# EAGLE design MQTTButton (EAGLE 9.3.0)
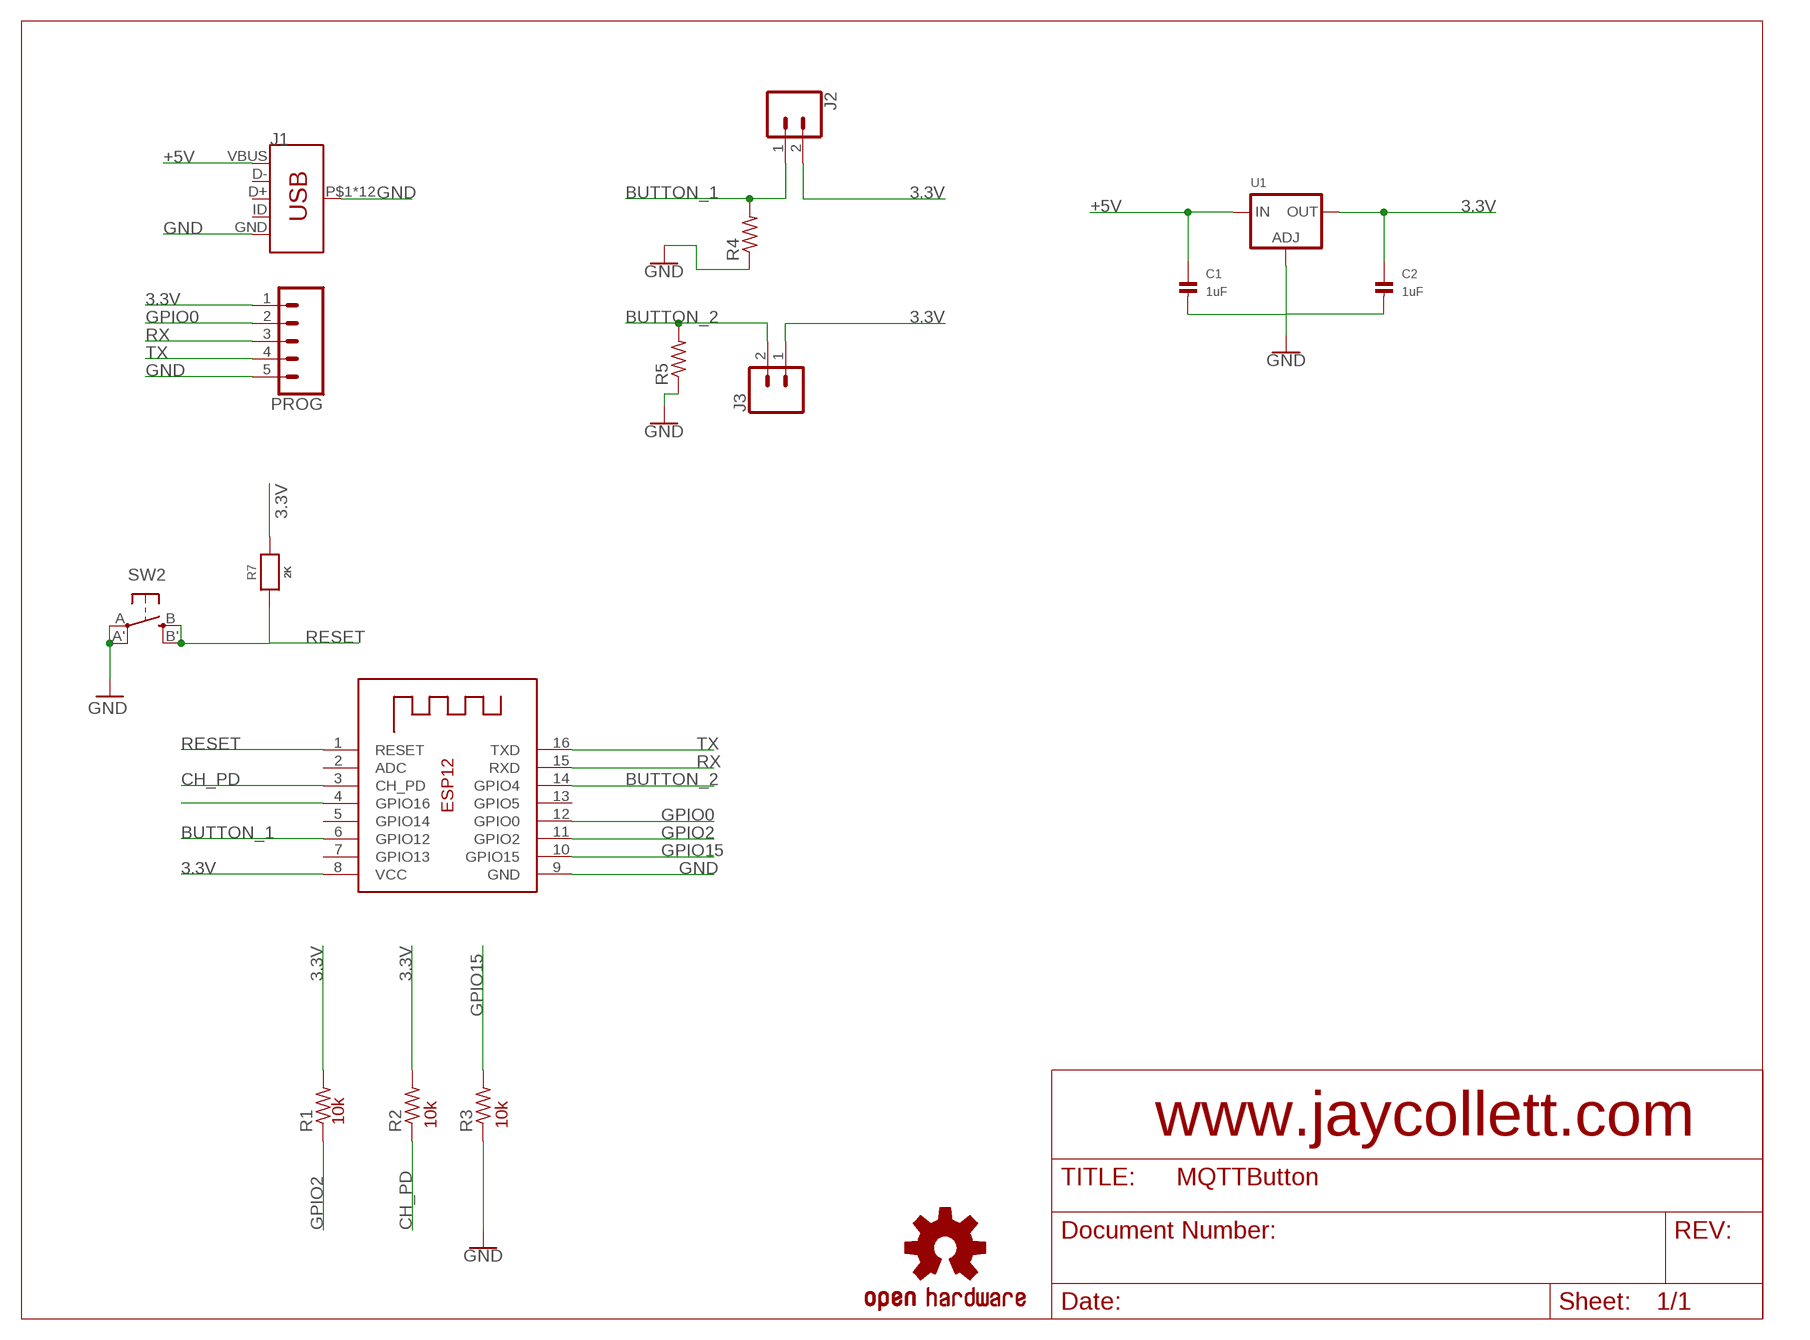
[diagram p0: schematic, sheet 1]

## Parts
C1  1uF  CAP_CERAMIC0805  [0805]
C2  1uF  CAP_CERAMIC0805  [0805]
J1  USB_MICRO-B_HALF_PTH  [USB-MICROB-PTH]
J2  CONN_02LOCK  [1X02_LOCK]
J3  CONN_02LOCK  [1X02_LOCK]
LOGO1  OSHW-LOGOMINI  [OSHW-LOGO-MINI]
PROG  CONN_05  [1X05]
R1  10k  R-US_M0805  [M0805]
R2  10k  R-US_M0805  [M0805]
R3  10k  R-US_M0805  [M0805]
R4  10k  R-US_M0805  [M0805]
R5  10k  R-US_M0805  [M0805]
R7  2K  RESISTOR0805_NOOUTLINE  [0805-NO]
SW2  SPST_TACT-EVQQ2  [EVQ-Q2]
U1  LM1117SOT223-WAVE  [SOT223-W]
X1  ESP-12  [ESP-12]

## Nets
3.3V [3.3V]: C2.1 J2.2 J3.1 PROG.1 R1.2 R2.2 R7.2 U1.2(OUT) X1.8(VCC)
+5V: C1.1 J1.VBUS U1.3(IN)
BUTTON_1: J2.1 R4.2 X1.6(GPIO12)
BUTTON_2: J3.2 R5.2 X1.14(GPIO4)
CH_PD: R2.1 X1.3(CH_PD)
GND: C1.2 C2.2 J1.GND J1.P$1(SHIELD) J1.P$2(SHIELD) J1.P$3(SHIELD) J1.P$4(SHIELD) J1.P$6(SHIELD) J1.P$8(SHIELD) J1.P$10(SHIELD) J1.P$12(SHIELD) J1.SHEILD2(SHIELD) J1.SHIELD J1.SHIELD3(SHIELD) J1.SHIELD4(SHIELD) PROG.5 R3.1 R4.1 R5.1 SW2.A'(P1) SW2.A(P) U1.1(ADJ) X1.9(GND)
GPIO0: PROG.2 X1.12(GPIO0)
GPIO2: R1.1 X1.11(GPIO2)
GPIO15: R3.2 X1.10(GPIO15)
N$4: X1.4(GPIO16)
RESET: R7.1 SW2.B'(S1) SW2.B(S) X1.1(RESET)
RX: PROG.3 X1.15(RXD)
TX: PROG.4 X1.16(TXD)
Unconnected: J1.D+ J1.D- J1.ID X1.2(ADC) X1.5(GPIO14) X1.7(GPIO13) X1.13(GPIO5)

## Notes on the sheet
- 10k | 10k | 10k
- www.jaycollett.com

## Library data of the parts
C1 C2 = microbuilder:CAP_CERAMIC: Ceramic Capacitors 0402 - 0402 Surface Mount Capacitors 16pF 50V 5% [Digikey: 445-4899-2-ND] 18pF 50V 5% [Digikey: 490-1281-2-ND] 22pF 50V 5% [Digikey: 490-1283-2-ND] 68pF 50V 5% [Digikey: 490-1289-2-ND] 0.1uF 10V 10% [Digikey: 490-1318-2-ND] 1.0uF 6.3V 10% [Digikey: 490-1320-2-ND] 0603 - 0603 Surface Mount Capacitors 16 pF 50V 5% [Digikey: 445-5051-2-ND] 22 pF 50V [Digikey: PCC220ACVTR-ND] 33 pF 50V 5% [Digikey: 490-1415-1-ND] 56pF 50V 5% [Digikey: 490-1421-1-ND] 220pF 50V 5% [Digikey: 445-1285-1-ND] 680 pF 50V 2200 pF 50V 5% C0G [Digikey: 445-1297-1-ND] 5600 pF 100V 5% X7R [Digikey: 478-3711-1-ND] 0.1 µF 25V 10% [Digikey: PCC2277TR-ND] 0.22 µF 16V 10% X7R [Digikey: 445-1318-1-ND] 1.0 µF 25V 10% [Digikey: 445-5146-2-ND] 0603 - RF Specific 3pF 250V +/-0.1pF RF [Digikey: 712-1347-1-ND] 18 pF 250V 5% [Digikey: 478-3505-1-ND or 712-1322-1-ND] 56 pF 250V 5% C0G RF [Digikey: 490-4867-1-ND] 68 pF 250V RF [Digikey: 490-4868-1-ND] 0805 - 0805 Surface Mount Capacitors 220 pF 250V 2% RF Ceramic Capacitor [Digikey: 712-1398-1-ND] 1000 pF 50V 2% NP0 Ceramic Capacitor [Digikey: 478-3760-1-ND] 0.1 µF 25V 10% Ceramic Capacitor [Digikey: PCC1828TR-ND] 1.0 µF 16V 10% Ceramic Capacitor[Digikey: 490-1691-2-ND] 10.0 µF 10V 10% Ceramic Capacitor[Digikey: 709-1228-1-ND] 10.0 uF 16V 10% Ceramic Capacitor [Digikey: 478-5165-2-ND] 47 uF 6.3V 20% Ceramic Capacitor [Digikey: 587-1779-1-ND or 399-5506-1-ND] 1206 - 1206 Surface Mount Capacitors 47uF 10V 20% Ceramic Capacitor [Digikey: 490-5528-1-ND or 399-5508-1-ND or 445-6010-1-ND] 100uF 6.3V -20%, +80% Y5V Ceramic Capacitor (Digikey: 490-4512-1-ND, Mouser: 81-GRM31CF50J107ZE1L)
J1 = SparkFun-Connectors:USB_MICRO-B: USB Type Micro-B Connector Male/female and PTH/SMT variants SparkFun Products: SparkFun microB USB Breakout <https://www.sparkfun.com/products/12035> SparkFun USB microB Plug Breakout <https://www.sparkfun.com/products/10031> SparkFun ESP8266 Thing <https://www.sparkfun.com/products/13231>; PROD_ID: CONN-13711; VALUE: AMP FCI 10103594-0001LF
J2 J3 = SparkFun-Connectors:CONN_02: Multi connection point. Often used as Generic Header-pin footprint for 0.1 inch spaced/style header connections On any of the 0.1 inch spaced packages, you can populate with these: Break Away Headers - Straight <https://www.sparkfun.com/products/116> (PRT-00116) Break Away Male Headers - Right Angle <https://www.sparkfun.com/products/553> (PRT-00553) Female Headers <https://www.sparkfun.com/products/115> (PRT-00115) Break Away Headers - Machine Pin <https://www.sparkfun.com/products/117> (PRT-00117) Break Away Female Headers - Swiss Machine Pin <https://www.sparkfun.com/products/743> (PRT-00743) For SCREWTERMINALS and SPRING TERMINALS visit here: Screw Terimnals on SparkFun.com <https://www.sparkfun.com/search/results?term=Screw+Terminals> (5mm/3.5mm/2.54mm spacing) This device is also useful as a general connection point to wire up your design to another part of your project. Our various solder wires solder well into these plated through hole pads. Hook-Up Wire - Assortment (Stranded, 22 AWG) <https://www.sparkfun.com/products/11375> (PRT-11375) Hook-Up Wire - Assortment (Solid Core, 22 AWG) <https://www.sparkfun.com/products/11367> (PRT-11367) View the entire wire category on our website here <https://www.sparkfun.com/categories/141> Special notes: Molex polarized connector foot print use with: PRT-08233 with associated crimp pins and housings. 2.54_SCREWTERM for use with PRT-10571. 3.5mm Screw Terminal footprints for PRT-08084 5mm Screw Terminal footprints for use with PRT-08432
LOGO1 = SparkFun-Aesthetics:OSHW-LOGO: Open-Source Hardware (OSHW) Logo This logo indicates the piece of hardware it is found on incorporates a OSHW license and/or adheres to the definition of open source hardware found here: http://freedomdefined.org/OSHW
PROG = SparkFun-Connectors:CONN_05: Multi connection point. Often used as Generic Header-pin footprint for 0.1 inch spaced/style header connections On any of the 0.1 inch spaced packages, you can populate with these: Break Away Headers - Straight <https://www.sparkfun.com/products/116> (PRT-00116) Break Away Male Headers - Right Angle <https://www.sparkfun.com/products/553> (PRT-00553) Female Headers <https://www.sparkfun.com/products/115> (PRT-00115) Break Away Headers - Machine Pin <https://www.sparkfun.com/products/117> (PRT-00117) Break Away Female Headers - Swiss Machine Pin <https://www.sparkfun.com/products/743> (PRT-00743) For SCREWTERMINALS and SPRING TERMINALS visit here: Screw Terimnals on SparkFun.com <https://www.sparkfun.com/search/results?term=Screw+Terminals> (5mm/3.5mm/2.54mm spacing) This device is also useful as a general connection point to wire up your design to another part of your project. Our various solder wires solder well into these plated through hole pads. Hook-Up Wire - Assortment (Stranded, 22 AWG) <https://www.sparkfun.com/products/11375> (PRT-11375) Hook-Up Wire - Assortment (Solid Core, 22 AWG) <https://www.sparkfun.com/products/11367> (PRT-11367) View the entire wire category on our website here <https://www.sparkfun.com/categories/141> Special notes: Molex polarized connector foot print use with SKU : PRT-08231 with associated crimp pins and housings. 1MM SMD Version SKU: PRT-10208
R1-R5 = adafruit:R-US_: RESISTOR, American symbol
R7 = microbuilder:RESISTOR: Resistors For new designs, use the packages preceded by an '_' character since they are more reliable: The following footprints should be used on most boards: _0402 - Standard footprint for regular board layouts _0603 - Standard footprint for regular board layouts _0805 - Standard footprint for regular board layouts _1206 - Standard footprint for regular board layouts For extremely tight-pitch boards where space is at a premium, the following 'micro-pitch' footprints can be used (smaller pads, no silkscreen outline, etc.): _0402MP - Micro-pitch footprint for very dense/compact boards _0603MP - Micro-pitch footprint for very dense/compact boards _0805MP - Micro-pitch footprint for very dense/compact boards _1206MP - Micro-pitch footprint for very dense/compact boards
SW2 = adafruit:SPST_TACT: SMT 6mm switch, EVQQ2 series http://www.ladyada.net/library/eagle
U1 = microbuilder:LM1117: LM1117 Voltage Regulator LM1117 Adjustable Voltage regulator [Digikey: LM1117IMP-ADJDKR-ND] LM1117 3.3V Voltage regulator [AP1117E33GDIDKR-ND] LM1117 5.0V Voltage regulator [AP1117E50GDIDKR-ND] SOT223-REFLOW - SOT223 package for solder paste/reflow ovens SOT223-WAVE - SOT223 package for hand-soldering (larger pads) Note: For the fixed-voltage regulators, simply set the ADJ pin to GND.
X1 = adafruit:ESP-12

## Net classes
1 3.3V: width 0.406 mm, clearance 0.203 mm to class 0

## Board
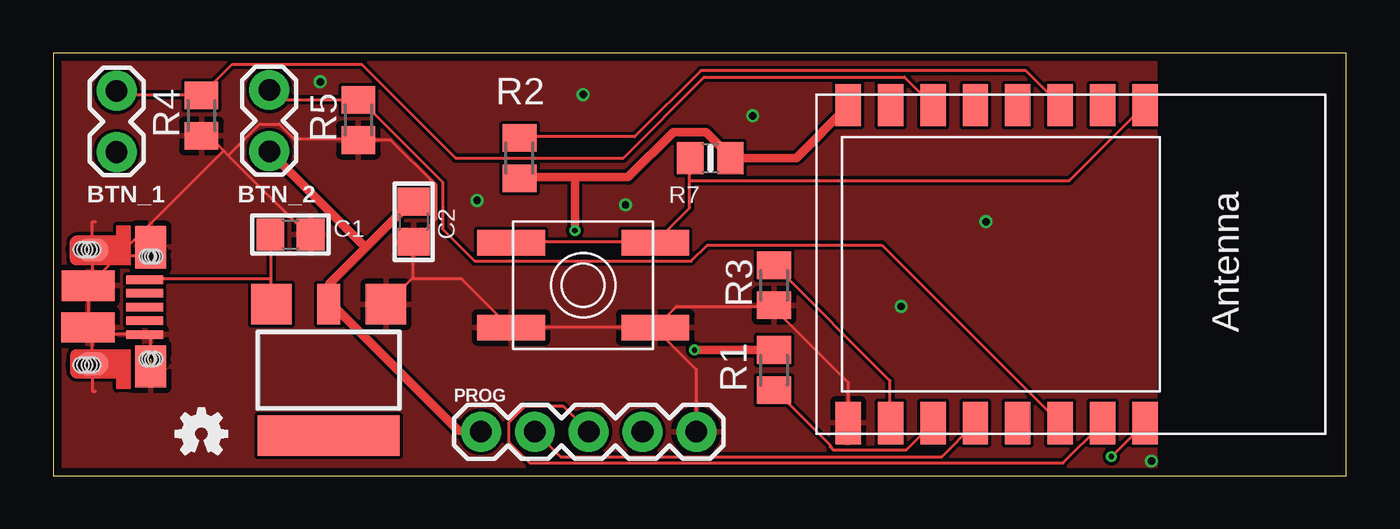
[diagram p1: board, top side]
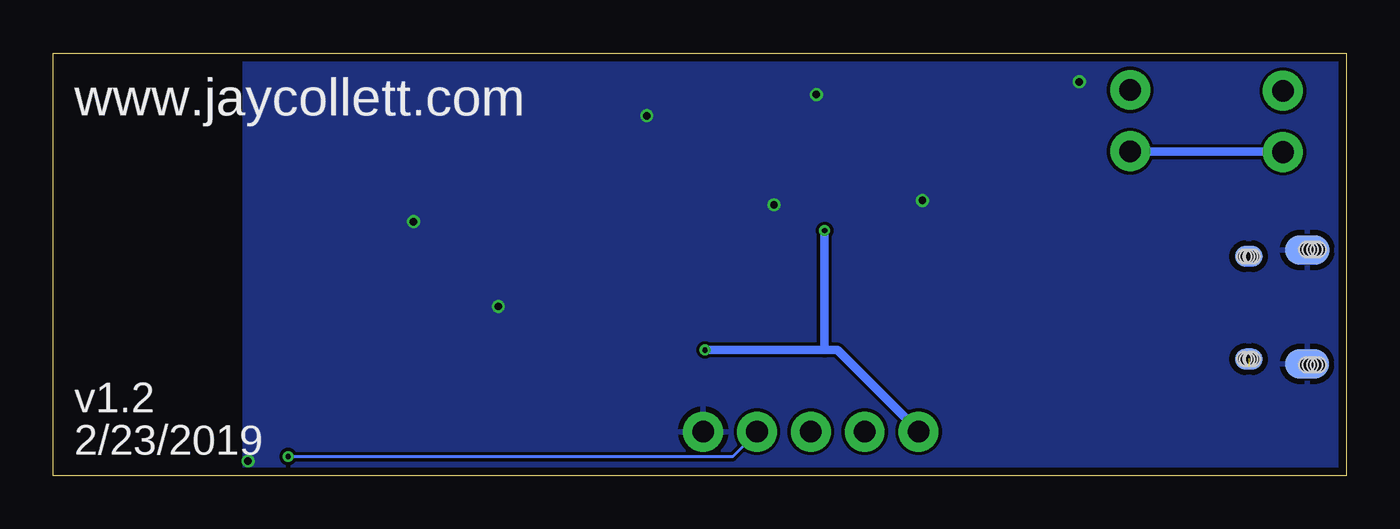
[diagram p2: board, bottom side, seen from below]

Size 61 x 19.96 mm. Coordinates in mm from the lower left corner, seen from the top.
Outline: 0,0 61,0 61,19.96 0,19.96 0,0
Copper layers (1*16): Top 0.035559375mm / dielectric 1.6mm / Bottom 0.035559375mm
Design rules "default": minimum track width 6mil, minimum drill 10mil, track to track 6mil, track to pad 6mil, pad to pad 6mil, via to via 6mil, smd to smd 6mil, copper to edge 15mil, drill to drill 6mil, minimum pad ring 5mil, minimum via ring 5mil, stop-mask expansion 2.5mil, vias tented up to drill 20mil, thermal gap 10mil

### Footprints (pad centres in the part's own frame; a part is rotated, then mirrored left to right if it is on the bottom)
0805 = smd 1.3 x 1.5: 1 -0.95,0; 2 0.95,0
USB-MICROB-PTH = smd 0.4 x 1.75: D+ 0.031,1.331; D- -0.619,1.331; GND 1.331,1.331; ID 0.681,1.331; VBUS -1.269,1.331 | smd 1.4 x 2.1 bottom: P$1 2.701,-1.142; P$3 -2.659,-1.144 | smd 1 x 1.3: P$2 2.487,1.594; P$6 -2.368,1.604 | smd 1 x 1.3 bottom: P$4 -2.368,1.604; P$10 2.481,1.598 | smd 1.1 x 1.5: P$8 2.701,-1.142; P$12 -2.659,-1.144 | smd 2 x 1.46: SHEILD2 2.831,1.606; SHIELD -2.794,1.606 | smd 1.425 x 2.5: SHIELD3 -0.979,-1.349; SHIELD4 0.996,-1.352 | hole 0.7: -2.693,-1.134; -2.693,-1.3; -2.694,-1.499; -2.694,-1.664; 2.768,-1.134; 2.767,-1.303; 2.766,-1.496; 2.766,-1.664 | hole 0.66: -2.359,1.821; -2.349,1.691; -2.359,1.541; -2.354,1.432; 2.481,1.821; 2.491,1.691; 2.481,1.541; 2.486,1.432
1X02_LOCK = drill 1.016 pad 1.88: 1 -0.178,0; 2 2.718,0
1X05 = drill 1.016 pad 1.88: 1 0,0; 2 2.54,0; 3 5.08,0; 4 7.62,0; 5 10.16,0
M0805 = smd 1.3 x 1.6: 1 -0.95,0; 2 0.95,0
0805-NO = smd 1.24 x 1.5: 1 -0.95,0; 2 0.95,0
EVQ-Q2 = smd 3.2 x 1.2: A -3.4,-2; A' 3.4,-2; B -3.4,2; B' 3.4,2
SOT223-W = smd 1.9 x 1.9: 1 -2.7,-3.1; 3 2.7,-3.1 | smd 1.1 x 1.9: 2 0,-3.1 | smd 6.7 x 1.9: 4 0,3.1
ESP-12 = smd 2 x 1.2: 1 -7.5,4.5; 2 -7.5,2.5; 3 -7.5,0.5; 4 -7.5,-1.5; 5 -7.5,-3.5; 6 -7.5,-5.5; 7 -7.5,-7.5; 8 -7.5,-9.5; 9 7.5,-9.5; 10 7.5,-7.5; 11 7.5,-5.5; 12 7.5,-3.5; 13 7.5,-1.5; 14 7.5,0.5; 15 7.5,2.5; 16 7.5,4.5

### Placement (x,y rotation side)
C1  11.2,11.4 0 top
C2  17,12 270 top
J1  3,8 270 top
J2  3,18 270 top
J3  10.2,15.5 90 top
LOGO1  7,2 0 top
PROG  20.18,2.09 0 top
R1  34,5 90 top
R2  22,15 270 top
R3  34,9 90 top
R4  7,17 90 top
R5  14.4,16.8 90 top
R7  31,15 0 top
SW2  25,9 0 top
U1  13,5 180 top
X1  47,10 270 top

### Tracks (layer width: path | path; a pad name or v marks a point on that pad's centre or on a via)
3.3V  (via drill 0.25)
  Top 0.406: 14.74,10.78 13.03,9.07 13.03,8.15 U1.2 13.18,8.08 19.13,2.13 20.12,2.13 PROG.1 | 14.74,10.78 16.84,12.88 16.99,12.88 C2.1 | 14.74,10.78 10.21,15.32 J3.1 | X1.8 37.49,17.45 35.05,15.01 32,15.01 R7.2 31.85,15.16 30.79,16.23 29.26,16.23 27.13,14.1 24.61,14.1 | 24.61,14.1 22.02,14.1 R2.2 | v30.25,5.94 33.98,5.94 R1.2 | v24.61,11.58 24.61,14.1
  Bottom 0.406: J2.2 3.05,15.32 10.13,15.32 J3.1 | 24.61,5.94 24,5.94 20.19,2.13 PROG.1 | 24.61,5.94 v30.25,5.94 | 24.61,5.94 v24.61,11.58
+5V
  Top 0.152: 10.29,9.3 10.29,8.15 U1.3 | 10.29,9.3 10.29,11.35 C1.1 | 10.29,9.3 4.34,9.3 J1.VBUS
BUTTON_1
  Top 0.152: J2.1 3.05,18.14 3.2,17.98 6.93,17.98 R4.2 7.01,17.98 8.46,19.43 14.55,19.43 18.97,15.01 26.9,15.01 30.71,18.82 40.16,18.82 41.45,17.53 X1.6
BUTTON_2
  Top 0.152: J3.2 10.21,18.21 10.67,17.75 14.33,17.75 R5.2 14.4,17.68 14.55,17.68 18.36,13.87 18.36,11.66 19.89,10.13 30.1,10.13 30.86,10.9 39.09,10.9 47.47,2.52 X1.14
CH_PD
  Top 0.152: R2.1 22.02,16 27.43,16 30.56,19.13 45.87,19.13 47.47,17.53 X1.3
GND  (via drill 0.35)  (3 unrouted)
  Top 0.152: 1.8,6.8 1.68,6.93 J1.SHIELD4 1.68,7.01 1.68,8.91 J1.SHIELD3 1.68,8.99 1.84,9.16 | 1.8,6.8 1.91,6.71 4.27,6.71 J1.GND 4.61,6.67 J1.SHEILD2 | 8.04,15.35 7.39,16 7.01,16 R4.1 | 8.04,15.35 8.27,15.13 | 8.27,15.13 11.96,11.43 12.12,11.43 C1.2 | 8.27,15.13 9.75,16.61 10.67,16.61 11.35,15.93 14.33,15.93 R5.1 15.93,15.85 18.06,13.72 18.06,12.12 17.07,11.12 C2.2 16.99,9.37 16.95,9.34 | 8.04,15.35 1.84,9.16 | 16.95,9.34 15.77,8.15 U1.1 | 16.95,9.34 16.99,9.3 19.28,9.3 21.57,7.01 SW2.A 21.64,7.01 28.35,7.01 SW2.A' | SW2.A' 28.42,7.01 29.41,8 33.98,8 R3.1 33.98,7.92 37.49,4.42 37.49,2.52 X1.9 | PROG.5 30.33,2.13 30.33,5.03 28.42,6.93 SW2.A' | 1.8,6.8 1.86,6.8 J1.P$8 1.86,4 2,4 | J1.P$3 1.86,9.16 1.84,9.16 | J1.P$4 1.86,10.37 J1.P$3 | J1.P$3 1.86,12 2,12
  other vias: 44,12 33,17 25,18 20,13 40,8 27,12.8 12.6,18.6 51.8,0.7
  pour Top (isolate 0.012): 0,20 52,20 52,0 0,0
  pour Bottom (isolate 0.012): 0,20 52,20 52,0 0,0
GPIO0
  Top 0.152: X1.12 43.43,2.44 41.91,0.91 23.93,0.91 22.78,2.06 PROG.2
GPIO2
  Top 0.152: R1.1 34.06,4.04 36.65,1.45 36.65,1.37 36.8,1.22 40.23,1.22 41.45,2.44 X1.11
GPIO15
  Top 0.152: R3.2 34.06,9.91 39.47,4.5 39.47,2.52 X1.10
RESET
  Top 0.152: 30.02,13.95 30.02,12.65 28.42,11.05 SW2.B' 28.35,11.05 21.64,11.05 SW2.B | 30.02,13.95 30.02,14.94 R7.1 | 30.02,13.95 47.93,13.95 51.44,17.45 X1.1
RX
  Top 0.152: X1.15 49.45,2.44 47.62,0.61 22.48,0.61 21.49,1.6 21.49,2.52 22.25,3.28 24.08,3.28 25.22,2.13 PROG.3
TX  (via drill 0.25)
  Top 0.152: v49.91,0.91 51.44,2.44 X1.16
  Bottom 0.152: v49.91,0.91 28.96,0.91 27.81,2.06 PROG.4

### Text on the board
bPlace: www.jaycollett.com | v1.2 | 2/23/2019
tNames: BTN_1 | BTN_2